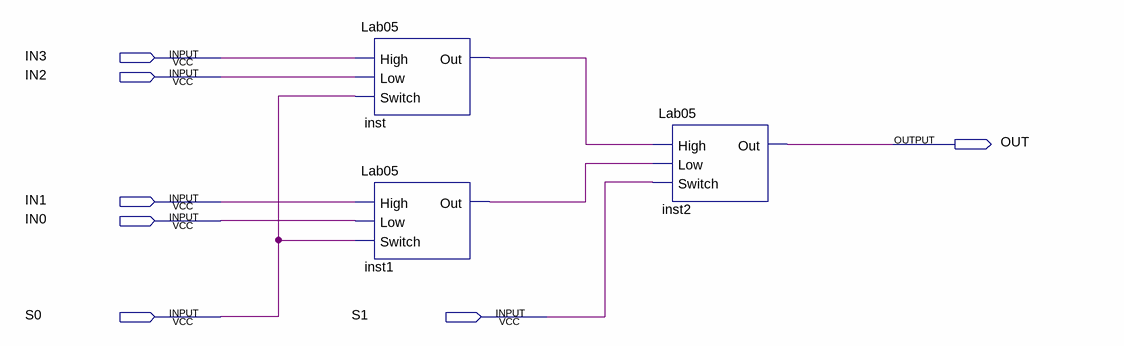
[diagram p0: schematic sheet]
// Quartus schematic Bigmux.bdf as structural Verilog: 3 symbols, 7 pins
module Bigmux (
  input  IN3,
  input  IN2,
  input  IN1,
  input  IN0,
  input  S0,
  input  S1,
  output OUT
);

  wire inst1_out, inst_out;

  Lab05 inst (.High(IN3), .Low(IN2), .Switch(S0), .Out(inst_out));
  Lab05 inst1 (.High(IN1), .Low(IN0), .Switch(S0), .Out(inst1_out));
  Lab05 inst2 (.High(inst_out), .Low(inst1_out), .Switch(S1), .Out(OUT));
endmodule
